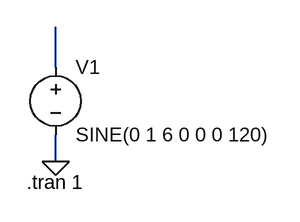
[diagram p0: schematic Draft1.asc]
Draft1.asc, the LTspice schematic file:
Version 4
SHEET 1 880 680
WIRE -160 144 -160 96
WIRE -160 256 -160 224
FLAG -160 256 0
SYMBOL voltage -160 128 R0
WINDOW 123 0 0 Left 0
WINDOW 39 0 0 Left 0
SYMATTR InstName V1
SYMATTR Value SINE(0 1 6 0 0 0 120)
TEXT -194 280 Left 2 !.tran 1

The netlist it stands for:
* Draft1.asc
V1 N001 0 SINE(0 1 6 0 0 0 120)
.tran 1
.backanno
.end